# EAGLE design fabflash-mk-2.1-controller (EAGLE 6.5.0)
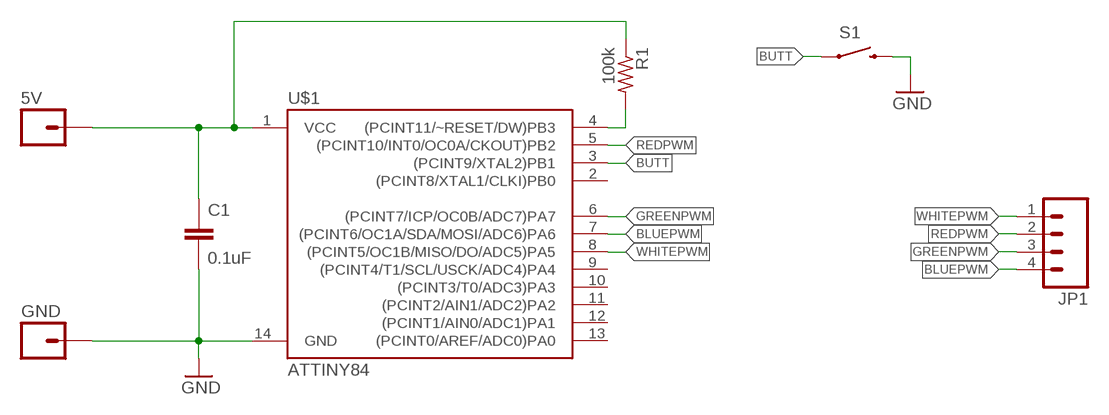
[diagram p0: schematic, sheet 1]

## Parts
5V  M01PTH-0.9MM  [1X01-0.9MM]
C1  0.1uF  CAPACITOR-CERAMICC0603  [C0603]
GND  M01PTH-0.9MM  [1X01-0.9MM]
JP1  M04JST-PTH-VERT  [JST-4-PH-VERT-PTH]
R1  100k  RESISTORR0603  [R0603]
S1  SWITCH-MOMENTARY-212MM  [TACTILE-PTH-12MM]
U$1  ATTINY84  [SO14]

## Nets
5V: 5V.1 C1.1 R1.1 U$1.1(VCC)
BLUEPWM: JP1.4 U$1.7((PCINT6/OC1A/SDA/MOSI/ADC6)PA6)
BUTT: S1.1 U$1.3((PCINT9/XTAL2)PB1)
GND: C1.2 GND.1 S1.3 U$1.14(GND)
GREENPWM: JP1.3 U$1.6((PCINT7/ICP/OC0B/ADC7)PA7)
N$2: R1.2 U$1.4((PCINT11/~RESET/DW)PB3)
REDPWM: JP1.2 U$1.5((PCINT10/INT0/OC0A/CKOUT)PB2)
WHITEPWM: JP1.1 U$1.8((PCINT5/OC1B/MISO/DO/ADC5)PA5)
Unconnected: U$1.2((PCINT8/XTAL1/CLKI)PB0) U$1.9((PCINT4/T1/SCL/USCK/ADC4)PA4) U$1.10((PCINT3/T0/ADC3)PA3) U$1.11((PCINT2/AIN1/ADC2)PA2) U$1.12((PCINT1/AIN0/ADC1)PA1) U$1.13((PCINT0/AREF/ADC0)PA0)

## Library data of the parts
5V GND = A_butts:M01: Header 1 Standard 1-pin 0.1" header. Use with straight break away headers (SKU : PRT-00116), right angle break away headers (PRT-00553), swiss pins (PRT-00743), machine pins (PRT-00117), and female headers (PRT-00115).
C1 = A_butts:CAPACITOR-CERAMIC: CAPACITOR, European symbol
JP1 = A_butts:M04: Header 4 Standard 4-pin 0.1" header. Use with straight break away headers (SKU : PRT-00116), right angle break away headers (PRT-00553), swiss pins (PRT-00743), machine pins (PRT-00117), and female headers (PRT-00115). Molex polarized connector foot print use with SKU : PRT-08231 with associated crimp pins and housings. 1MM SMD Version SKU: PRT-10208
R1 = A_butts:RESISTOR: RESISTOR, American symbol
S1 = A_butts:SWITCH-MOMENTARY-2: Various NO switches- pushbuttons, reed, etc; PROD_ID: SWCH-09185
U$1 = A_butts:ATTINY84: Atmel 14-pin 2/4/8kB flash uC

## Board
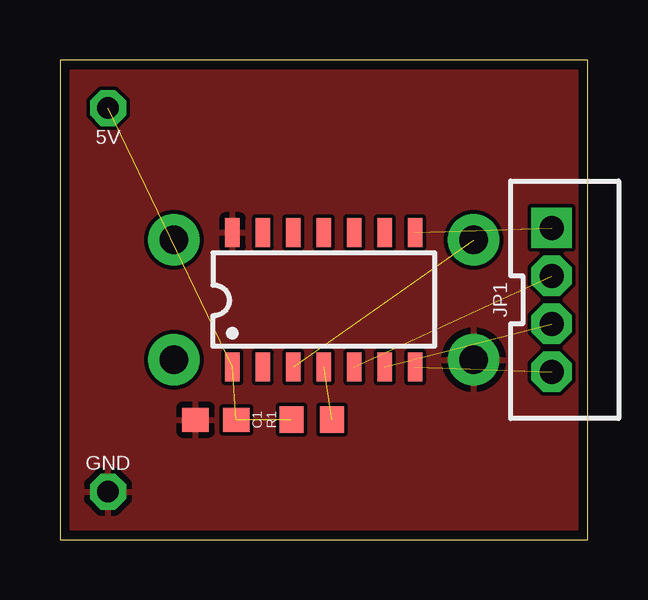
[diagram p1: board, top side]
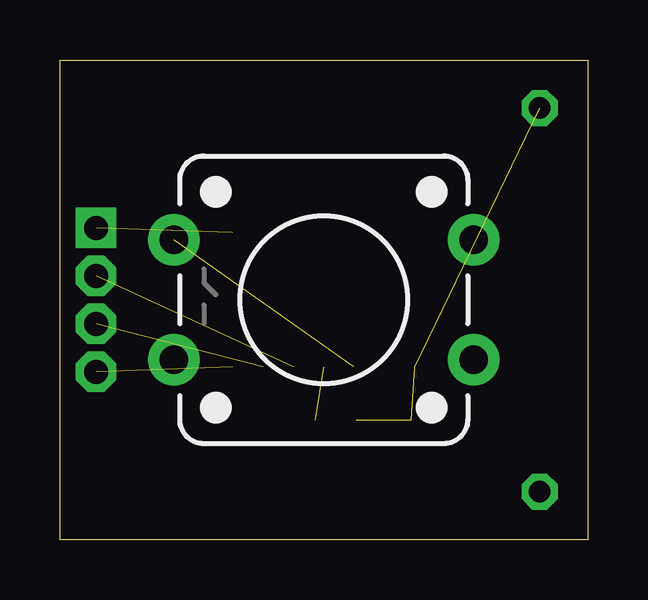
[diagram p2: board, bottom side, seen from below]

Size 22 x 20 mm. Coordinates in mm from the lower left corner, seen from the top.
Outline: 0,0 22,0 22,20 0,20 0,0
Copper layers (1*16): Top 0.0356mm / dielectric 1.5011mm / Bottom 0.0356mm
Design rules "LaenPCBOrder2": minimum track width 6mil, minimum drill 13mil, track to track 6mil, track to pad 6mil, pad to pad 6mil, via to via 6mil, smd to smd 6mil, copper to edge 15mil, drill to drill 6mil, minimum pad ring 7mil, minimum via ring 7mil, stop-mask expansion 3mil, vias tented up to drill 20mil, thermal gap 10mil

### Footprints (pad centres in the part's own frame; a part is rotated, then mirrored left to right if it is on the bottom)
1X01-0.9MM = drill 0.9 pad 1.5 octagon: 1 0,0
C0603 = smd 1.1 x 1: 1 -0.85,0; 2 0.85,0
JST-4-PH-VERT-PTH = drill 1 pad 1.676 square: 1 0,0 | drill 1 pad 1.676 octagon: 2 2,0; 3 4,0; 4 6,0
R0603 = smd 1 x 1.1: 1 -0.85,0; 2 0.85,0
TACTILE-PTH-12MM = drill 1.2 pad 2.159: 1 6.25,-2.5; 2 -6.25,-2.5; 3 6.25,2.5; 4 -6.25,2.5
SO14 = smd 0.6 x 1.2: 1 -3.81,-2.8; 2 -2.54,-2.8; 3 -1.27,-2.8; 4 0,-2.8; 5 1.27,-2.8; 6 2.54,-2.8; 7 3.81,-2.8; 8 3.81,2.8; 9 2.54,2.8; 10 1.27,2.8; 11 0,2.8; 12 -1.27,2.8; 13 -2.54,2.8; 14 -3.81,2.8

### Placement (x,y rotation side)
5V  2,18 180 top
C1  6.5,5 180 top
GND  2,2 0 top
JP1  20.5,13 270 top
R1  10.5,5 0 top
S1  11,10 180 bottom
U$1  11,10 0 top

### Tracks (layer width: path | path; a pad name or v marks a point on that pad's centre or on a via)
5V  (3 unrouted)
BLUEPWM  (1 unrouted)
BUTT  (1 unrouted)
GND
  pour Top: 0,0 0,20 22,20 22,0
GREENPWM  (1 unrouted)
N$2  (1 unrouted)
REDPWM  (1 unrouted)
WHITEPWM  (1 unrouted)